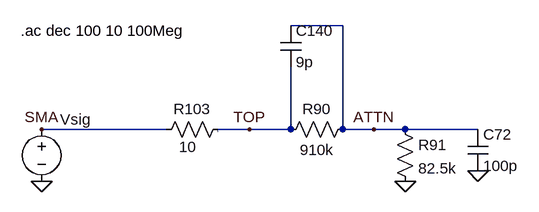
[diagram p0: schematic adc-v2-input-only.asc]
adc-v2-input-only.asc, the LTspice schematic file:
Version 4
SHEET 1 1156 680
WIRE 464 272 384 272
WIRE 192 432 0 432
WIRE 320 432 272 432
WIRE 384 432 384 336
WIRE 384 432 320 432
WIRE 464 432 464 272
WIRE 512 432 464 432
WIRE 560 432 512 432
WIRE 672 432 560 432
FLAG 0 512 0
FLAG 0 432 SMA
FLAG 320 432 TOP
FLAG 512 432 ATTN
FLAG 560 512 0
FLAG 672 496 0
SYMBOL voltage 0 416 R0
WINDOW 0 29 1 Left 2
SYMATTR InstName Vsig
SYMATTR Value ""
SYMATTR Value2 AC 1 0
SYMBOL Res 288 416 R90
WINDOW 0 0 56 VBottom 2
WINDOW 3 27 63 VTop 2
SYMATTR InstName R103
SYMATTR Value 10
SYMBOL Res 480 416 R90
WINDOW 0 0 56 VBottom 2
WINDOW 3 32 56 VTop 2
SYMATTR InstName R90
SYMATTR Value 910k
SYMBOL Res 544 416 R0
SYMATTR InstName R91
SYMATTR Value 82.5k
SYMBOL Cap 368 272 R0
SYMATTR InstName C140
SYMATTR Value 9p
SYMBOL Cap 656 432 R0
SYMATTR InstName C72
SYMATTR Value 100p
TEXT -32 280 Left 2 !.ac dec 100 10 100Meg
LINE Normal 272 436 272 432 2

The netlist it stands for:
* adc-v2-input-only.asc
Vsig SMA 0 AC 1 0
R103 TOP SMA 10
R90 ATTN TOP 910k
R91 ATTN 0 82.5k
C140 ATTN TOP 9p
C72 ATTN 0 100p
.ac dec 100 10 100Meg
.backanno
.end